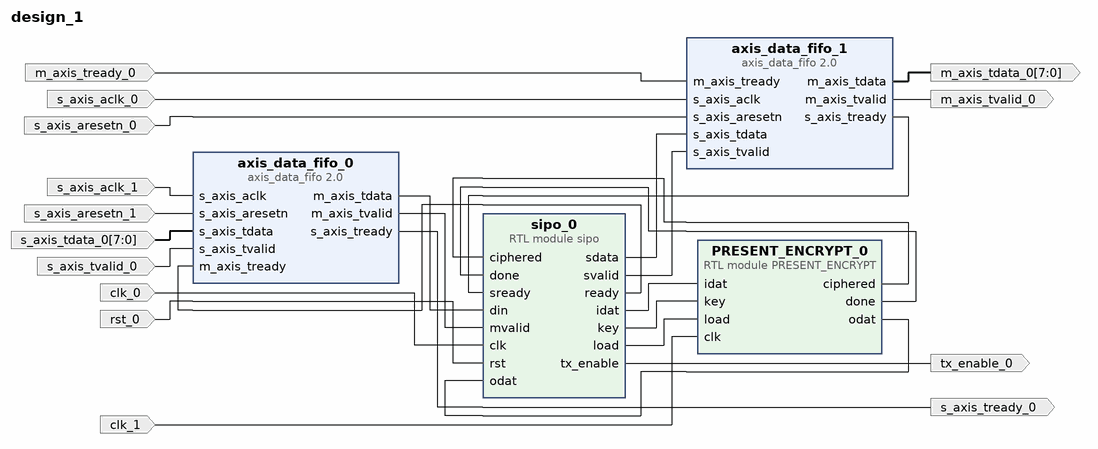
[diagram p0: block diagram of the top level]
# Vivado block design design_1, xc7a100tcsg324-1, Vivado 2023.2
create_bd_design design_1

create_bd_port -dir O s_axis_tready_0
create_bd_port -dir I s_axis_tvalid_0
create_bd_port -dir I -from 7 -to 0 s_axis_tdata_0
create_bd_port -dir O -from 7 -to 0 m_axis_tdata_0
create_bd_port -dir I m_axis_tready_0
create_bd_port -dir O m_axis_tvalid_0
create_bd_port -dir O tx_enable_0
create_bd_port -dir I -type rst s_axis_aresetn_0
create_bd_port -dir I -type rst rst_0
create_bd_port -dir I -type clk s_axis_aclk_0
create_bd_port -dir I -type rst s_axis_aresetn_1
create_bd_port -dir I -type clk clk_0
create_bd_port -dir I -type clk s_axis_aclk_1
create_bd_port -dir I -type clk clk_1

create_bd_cell -type ip -vlnv xilinx.com:ip:axis_data_fifo:2.0 axis_data_fifo_0
set_property -dict {CONFIG.FIFO_DEPTH 16} [get_bd_cells axis_data_fifo_0]
create_bd_cell -type ip -vlnv xilinx.com:ip:axis_data_fifo:2.0 axis_data_fifo_1
set_property -dict {CONFIG.FIFO_DEPTH 16} [get_bd_cells axis_data_fifo_1]
create_bd_cell -type module -reference sipo sipo_0
create_bd_cell -type module -reference PRESENT_ENCRYPT PRESENT_ENCRYPT_0

# ---- connections ----

connect_bd_net [get_bd_pins PRESENT_ENCRYPT_0/ciphered] [get_bd_pins sipo_0/ciphered]
connect_bd_net [get_bd_pins PRESENT_ENCRYPT_0/done] [get_bd_pins sipo_0/done]
connect_bd_net [get_bd_pins PRESENT_ENCRYPT_0/odat] [get_bd_pins sipo_0/odat]
connect_bd_net [get_bd_pins axis_data_fifo_0/m_axis_tdata] [get_bd_pins sipo_0/din]
connect_bd_net [get_bd_pins axis_data_fifo_0/m_axis_tvalid] [get_bd_pins sipo_0/mvalid]
connect_bd_net [get_bd_pins axis_data_fifo_0/s_axis_tready] [get_bd_ports s_axis_tready_0]
connect_bd_net [get_bd_pins axis_data_fifo_1/m_axis_tdata] [get_bd_ports m_axis_tdata_0]
connect_bd_net [get_bd_pins axis_data_fifo_1/m_axis_tvalid] [get_bd_ports m_axis_tvalid_0]
connect_bd_net [get_bd_pins axis_data_fifo_1/s_axis_tready] [get_bd_pins sipo_0/sready]
connect_bd_net -net clk_0_1 [get_bd_ports clk_0] [get_bd_pins sipo_0/clk]
connect_bd_net -net clk_1_1 [get_bd_ports clk_1] [get_bd_pins PRESENT_ENCRYPT_0/clk]
connect_bd_net -net m_axis_tready_0_1 [get_bd_ports m_axis_tready_0] [get_bd_pins axis_data_fifo_1/m_axis_tready]
connect_bd_net -net rst_0_1 [get_bd_ports rst_0] [get_bd_pins sipo_0/rst]
connect_bd_net -net s_axis_aclk_0_1 [get_bd_ports s_axis_aclk_0] [get_bd_pins axis_data_fifo_1/s_axis_aclk]
connect_bd_net -net s_axis_aclk_1_1 [get_bd_ports s_axis_aclk_1] [get_bd_pins axis_data_fifo_0/s_axis_aclk]
connect_bd_net -net s_axis_aresetn_0_1 [get_bd_ports s_axis_aresetn_0] [get_bd_pins axis_data_fifo_1/s_axis_aresetn]
connect_bd_net -net s_axis_aresetn_1_1 [get_bd_ports s_axis_aresetn_1] [get_bd_pins axis_data_fifo_0/s_axis_aresetn]
connect_bd_net -net s_axis_tdata_0_1 [get_bd_ports s_axis_tdata_0] [get_bd_pins axis_data_fifo_0/s_axis_tdata]
connect_bd_net -net s_axis_tvalid_0_1 [get_bd_ports s_axis_tvalid_0] [get_bd_pins axis_data_fifo_0/s_axis_tvalid]
connect_bd_net [get_bd_pins sipo_0/idat] [get_bd_pins PRESENT_ENCRYPT_0/idat]
connect_bd_net [get_bd_pins sipo_0/key] [get_bd_pins PRESENT_ENCRYPT_0/key]
connect_bd_net [get_bd_pins sipo_0/load] [get_bd_pins PRESENT_ENCRYPT_0/load]
connect_bd_net [get_bd_pins sipo_0/ready] [get_bd_pins axis_data_fifo_0/m_axis_tready]
connect_bd_net [get_bd_pins sipo_0/sdata] [get_bd_pins axis_data_fifo_1/s_axis_tdata]
connect_bd_net [get_bd_pins sipo_0/svalid] [get_bd_pins axis_data_fifo_1/s_axis_tvalid]
connect_bd_net [get_bd_pins sipo_0/tx_enable] [get_bd_ports tx_enable_0]

validate_bd_design
save_bd_design
